# Altium schematic sheet Distortion Effect Circuit.SchDoc: Electric Guitar Distortion Effect Circuit Design
size A4; DrawnBy: Mustafa Arda Gür; Revision: 1.0
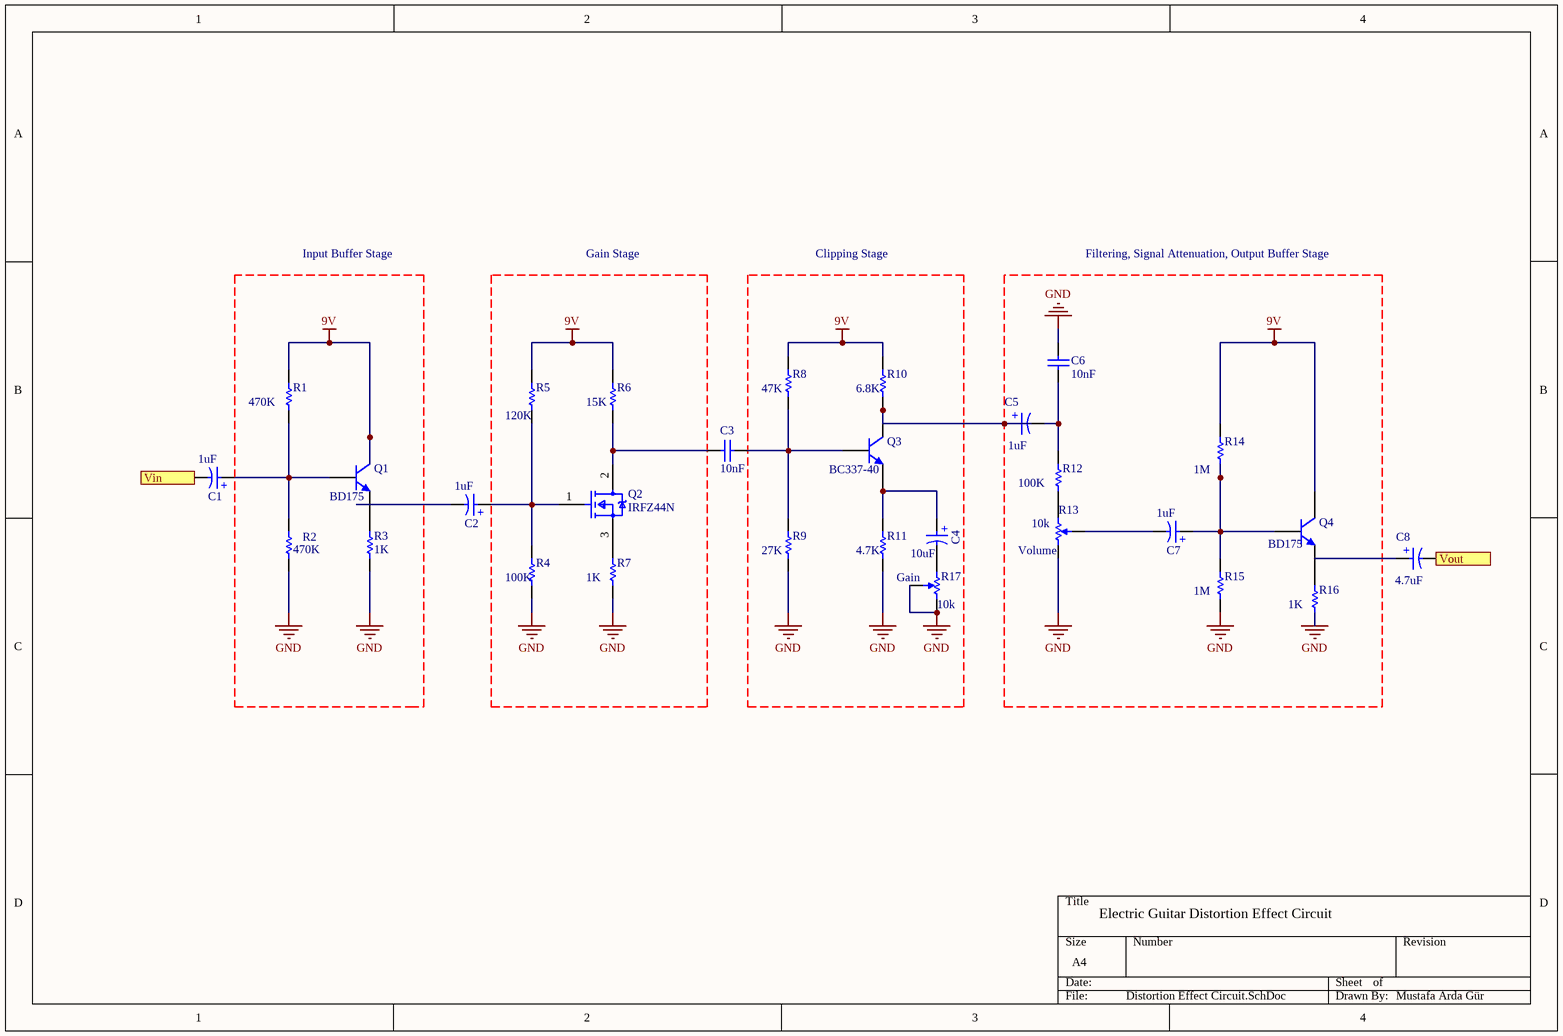
[diagram p0: Distortion Effect Circuit.SchDoc]

## Parts
C1  1uF  [WCAP-ATG5_D5H11]
C2  1uF  [WCAP-ATG5_D5H11]
C3  value 10nF  (hidden comment: Capacitor)
C4  10uF  [WCAP-ATG5_D5H11]
C5  1uF  [WCAP-ATG5_D5H11]
C6  value 10nF  (hidden comment: Capacitor)
C7  1uF  [WCAP-ATG5_D5H11]
C8  4.7uF  [WCAP-ATG5_D5H11]
Q1  BD175
Q2  IRFZ44N  [FP-PG-TO262-3-MFG]
Q3  BC337-40
Q4  BD175
R1  value 470K  (hidden comment: Resistor)
R2  value 470K  (hidden comment: Resistor)
R3  value 1K  (hidden comment: Resistor)
R4  value 100K  (hidden comment: Resistor)
R5  value 120K  (hidden comment: Resistor)
R6  value 15K  (hidden comment: Resistor)
R7  value 1K  (hidden comment: Resistor)
R8  value 47K  (hidden comment: Resistor)
R9  value 27K  (hidden comment: Resistor)
R10  value 6.8K  (hidden comment: Resistor)
R11  value 4.7K  (hidden comment: Resistor)
R12  value 100K  (hidden comment: Resistor)
R13  10k  [BI-35WR10KLFTR-3_V]
R14  value 1M  (hidden comment: Resistor)
R15  value 1M  (hidden comment: Resistor)
R16  value 1K  (hidden comment: Resistor)
R17  10k  [BI-35WR10KLFTR-3_V]

## Blocks framed on the sheet
Input Buffer Stage: Q1 R1-R3
Gain Stage: Q2 R4-R7

## Ports
Vin, Vout

## Nets
9V: Q1.1(C) Q4.1(C) R1.2 R5.2 R6.2 R8.2 R10.2 R14.2
GND: C6.2 R2.1 R3.1 R4.1 R7.1 R9.1 R11.1 R13.1 R15.1 R16.1 R17.2 R17.3
Vin: C1.2(N) ; port Vin
Vout: C8.2(N) ; port Vout
NetC1_1: C1.1(P) Q1.2(B) R1.1 R2.2
NetC2_1: C2.1(P) Q2.1(G) R4.2 R5.1
NetC3_1: C3.1 Q3.2(B) R8.1 R9.2
NetC3_2: C3.2 Q2.2(D) R6.1
NetC4_1: C4.1(P) Q3.3(E) R11.2
NetC4_2: C4.2(N) R17.1
NetC5_1: C5.1(P) Q3.1(C) R10.1
NetC5_2: C5.2(N) C6.1 R12.2
NetC7_1: C7.1(P) Q4.2(B) R14.1 R15.2
NetC7_2: C7.2(N) R13.2
NetQ1_3: Q1.3(E) R3.2
NetQ2_3: Q2.3(S) R7.2
NetQ4_3: Q4.3(E) R16.2
NetR12_1: R12.1 R13.3

Not connected (* = marked no-connect by the designer): C2 2(N); C8 1(P)

## Notes on the sheet
- Clipping Stage
- Filtering, Signal Attenuation, Output Buffer Stage
- (near R17) Gain
- (near R13) Volume
- Electric Guitar Distortion Effect Circuit
- Mustafa Arda Gür
- (in symbol CMP-03913-53914135-2) +

## Library data of the parts
C1 C2 C4 C5 C7 C8 = CMP-03913-53914135-2: WCAP-ATG5 Aluminum Electrolytic Capacitors; Pitch: 2mm; Life (Hours): 2000hours; Polarity: Polar; Tolerance: 20%; Capacitance: 47µF; Leakage Current: 4.7µA; Ripple Current: 70mA; Voltage Rating: 10V; RoHS: Compliant; Lead Pitch: 2.0066mm; Diameter: 5mm; Min Operating Temperature: -40°C; Case/Package: Radial; Mount: Through Hole; Length: 11mm; Height - Seated (Max): 12.4968mm; Max Operating Temperature: 105°C; Packaging: Tape & Box (TB)
C3 C6 = Capacitor: SimulationGenericComponent: True
Q1 Q3 Q4 = BJT NPN VBIC: Bipolar NPN 3 Pins Transistor VBIC Model; SimulationGenericComponent: True; AFN: 1; AJC: -0.5; ART: 0.1; AVC1: 0; EA: 1.12; FC: 0.9; IBBE: 1e-06; IBCI: 1e-16; IBEI: 1e-18; MC: 0.33; NCN: 2; NKF: 0.5; PC: 0.75; TNOM: 27; VERS: 1.2; XII: 3; AJE: -0.5; AJS: -0.5; AVC2: 0; BFN: 1; CBCO: 0; CBEO: 0; CCSO: 0; CJC: 0; CJCP: 0; CJE: 0; CJEP: 0; CTH: 0; DEAR: 0; EAIC: 1.12; EAIE: 1.12; EAIS: 1.12; EANC: 1.12; EANE: 1.12; EANS: 1.12; EAP: 1.12; EBBE: 0; GAMM: 0; HRCF: 1; IBCIP: 0; IBCN: 0; IBCNP: 0; IBEIP: 0; IBEN: 0; IBENP: 0; IKF: 0; IKP: 0; IKR: 0; IS: 1e-16; ISP: 0; ISRR: 1; ITF: 0; KFN: 0; ME: 0.33; MS: 0.33; NBBE: 1; NCI: 1; NCIP: 1; NCNP: 2; NEI: 1; NEN: 2; NF: 1; NFP: 1; NR: 1; PE: 0.75; PS: 0.75; QBM: 0; QCO: 0; QTF: 0; RBI: 0.1; RBP: 0.1; RBX: 0; RCI: 0.1; RCX: 0; RE: 0; RS: 0; RTH: 0; TAVC: 0; TD: 0; TF: 0; TNBBE: 0; TNF: 0; TR: 0; TVBBE1: 0; TVBBE2: 0; VBBE: 0; VEF: 0; VER: 0; VO: 0; VREF: 0; VRT: 0; VTF: 0; WBE: 1; WSP: 1; XIKF: 0; XIN: 3; XIS: 3; XISR: 0; XRBI: 0; XRBP: 0; XRBX: 0; XRCI: 0; XRCX: 0; XRE: 0; XRS: 0; XTF: 0; XVO: 0
Q2 = CMP-00196-65874408-1: IRFZ44NLPBF Single N-Channel 55 V 17.5 mOhm 63 nC HEXFET® Power Mosfet - TO-262; Resistance: 17.5MΩ; Turn-On Delay Time: 12ns; Drain to Source Breakdown Voltage: 55V; Threshold Voltage: 4V; Rise Time: 60ns; Input Capacitance: 1.47nF; Power Dissipation: 110W; Max Junction Temperature (Tj): 175°C; Gate to Source Voltage (Vgs): 20V; Number of Channels: 1; Fall Time: 45ns; Max Power Dissipation: 3.8W; Continuous Drain Current (ID): 49A; Turn-Off Delay Time: 44ns; Case/Package: TO-262; Lifecycle Status: Production; Packaging: Bulk; RoHS: Compliant; Radiation Hardening: No; Height: 9.65mm; Voltage Rating (DC): 55V; On-State Resistance: 17.5mΩ; Width: 4.826mm; Mount: Through Hole; Max Operating Temperature: 175°C; Schedule B: 8541290080, 8541290080; Termination: Through Hole; Dual Supply Voltage: 55V; Package Quantity: 1000; Min Operating Temperature: -55°C; Lead Free: Contains Lead, Lead Free; Drain to Source Voltage (Vdss): 55V; Element Configuration: Single; Length: 10.668mm; Rds On Max: 17.5mΩ; Number of Pins: 3; Current Rating: 49A; REACH SVHC: No SVHC; Drain to Source Resistance: 17.5mΩ; NexarPartId: 65874408; Number of Elements: 1; Nominal Vgs: 4V
R1-R12 R14-R16 = Resistor: TC1: 0; SimulationGenericComponent: True; TC2: 0
R13 R17 = CMP-009-00041-2: 3 mm Single-Turn Open Frame Surface Mount Cermet Trimming Potentiometer, +/- 25%, 35 W, -40 to 125 degC, 3-Pin SMD, RoHS, Tape and Reel; Manufacturer: BI Technologies; Power: 100mW; Voltage Rating: 50V; Mounting Technology: SM; RoHS Compliant: True; Manufacturer URL: http://www.bi-technologies.net/; Resistance: 10k; Package Quantity: 2000; Package Description: 3-Pin Surface Mount Device, Body 3 x 3.1 mm; Max Operating Temperature: 125°C; Composition: Potentiometer; Packaging: TapeandReel; Datasheet Version: Feb-10; Datasheet URL: http://www.bitechnologies.com/pdfs/35.pdf; Min Operating Temperature: -40°C; Package Reference: 35WR10KLFTR; Case/Package: 35WR10KLFTR; Tolerance: 25%